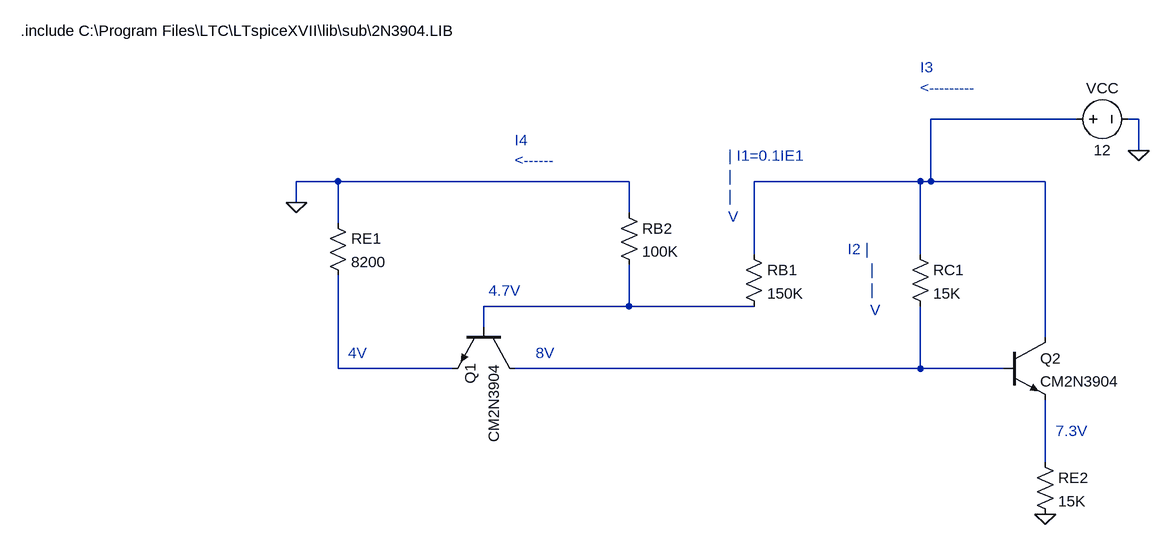
[diagram p0: schematic Part 2 circuit DC.asc]
Part 2 circuit DC.asc, the LTspice schematic file:
Version 4
SHEET 1 1800 932
WIRE 1568 160 1344 160
WIRE 1664 160 1648 160
WIRE 1664 208 1664 160
WIRE 432 256 368 256
WIRE 880 256 432 256
WIRE 1328 256 1072 256
WIRE 1344 256 1344 160
WIRE 1344 256 1328 256
WIRE 1520 256 1344 256
WIRE 368 288 368 256
WIRE 880 304 880 256
WIRE 432 320 432 256
WIRE 1072 368 1072 256
WIRE 1328 368 1328 256
WIRE 880 448 880 384
WIRE 880 448 656 448
WIRE 1072 448 880 448
WIRE 656 480 656 448
WIRE 1520 496 1520 256
WIRE 432 544 432 400
WIRE 608 544 432 544
WIRE 1328 544 1328 448
WIRE 1328 544 704 544
WIRE 1456 544 1328 544
WIRE 1520 688 1520 592
FLAG 368 288 0
FLAG 1520 768 0
FLAG 1664 208 0
SYMBOL res 416 304 R0
SYMATTR InstName RE1
SYMATTR Value 8200
SYMBOL npn 704 480 R90
SYMATTR InstName CM2N3904
SYMATTR Value Q1
SYMBOL res 1056 352 R0
SYMATTR InstName RB1
SYMATTR Value 150K
SYMBOL res 1312 352 R0
SYMATTR InstName RC1
SYMATTR Value 15K
SYMBOL npn 1456 496 R0
SYMATTR InstName Q2
SYMATTR Value CM2N3904
SYMBOL res 1504 672 R0
SYMATTR InstName RE2
SYMATTR Value 15K
SYMBOL voltage 1552 160 R270
WINDOW 0 32 56 VTop 2
WINDOW 3 -32 56 VBottom 2
WINDOW 123 0 0 Left 0
WINDOW 39 0 0 Left 0
SYMATTR InstName VCC
SYMATTR Value 12
SYMBOL res 864 288 R0
SYMATTR InstName RB2
SYMATTR Value 100K
TEXT -56 24 Left 2 !.include C:\\Program Files\\LTC\\LTspiceXVII\\lib\\sub\\2N3904.LIB
TEXT 448 520 Left 2 ;4V
TEXT 1032 216 Left 2 ;| I1=0.1IE1\n|\n|       \nV
TEXT 736 520 Left 2 ;8V
TEXT 664 424 Left 2 ;4.7V
TEXT 1536 640 Left 2 ;7.3V
TEXT 1216 360 Left 2 ;I2 |\n     |\n     |\n     V
TEXT 1328 80 Left 2 ;I3\n<---------
TEXT 704 192 Left 2 ;I4\n<------

The netlist it stands for:
* Part 2 circuit DC.asc
RE1 0 N003 8200
Q§CM2N3904 N004 N002 N003 0 Q1
RB1 N001 N002 150K
RC1 N001 N004 15K
Q2 N001 N004 N005 0 CM2N3904
RE2 N005 0 15K
VCC N001 0 12
RB2 0 N002 100K
.model NPN NPN
.model PNP PNP
.lib standard.bjt
.include C:\Program Files\LTC\LTspiceXVII\lib\sub\2N3904.LIB
* 4V
* | I1=0.1IE1
* |
* |
* V
* 8V
* 4.7V
* 7.3V
* I2 |
*      |
*      |
*      V
* I3
* <---------
* I4
* <------
.backanno
.end